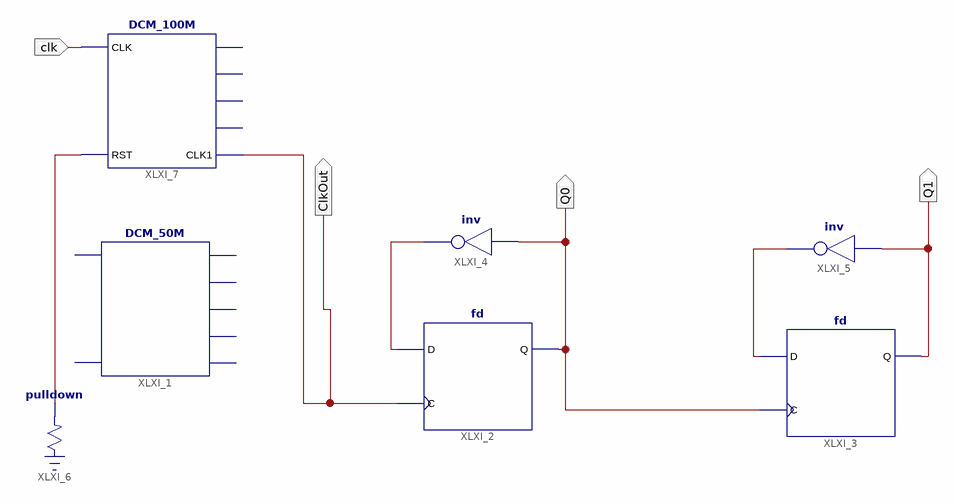
[diagram p0: schematic sheet 1]
// Xilinx ISE schematic Exp1Div2RippleCounter.sch (spartan3e) as structural Verilog: 7 symbols, 4 ports
module Exp1Div2RippleCounter (
  input  clk,
  output Q0,
  output Q1,
  output ClkOut
);

  wire XLXN_2, XLXN_6, XLXN_20;

  DCM_50M XLXI_1 ();  // open: CLK, RST, CLK1M, CLK10k, CLK1k, CLK100, CLK1
  fd XLXI_2 (.C(ClkOut), .D(XLXN_2), .Q(Q0));
  fd XLXI_3 (.C(Q0), .D(XLXN_6), .Q(Q1));
  not XLXI_4 (XLXN_2, Q0);
  not XLXI_5 (XLXN_6, Q1);
  \pulldown  XLXI_6 (.O(XLXN_20));
  DCM_100M XLXI_7 (.CLK(clk), .RST(XLXN_20), .CLK1(ClkOut));  // open: CLK1M, CLK10k, CLK1k, CLK100
endmodule
